# Altium schematic sheet F.SchDoc
size A
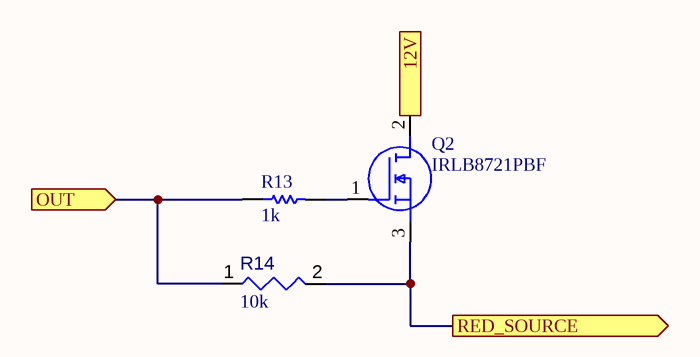
[diagram p0: F.SchDoc]

## Parts
Q2  IRLB8721PBF  [TO254P483X1016X1994-3P]
R13  value 1k  [RESC3116X70X50ML13T20]  (hidden comment: Resistor 1k +/-1% 1206 250 mW)
R14  value 10k  [RESC2013X50X35ML15T15]  (hidden comment: Resistor 10k +/-1% 0805 125 mW)

## Ports
12V (in), OUT (in), RED_SOURCE (out)

## Nets
12V: Q2.2(D) ; port 12V
OUT: R13.1 R14.1 ; port OUT
RED_SOURCE: Q2.3(S) R14.2 ; port RED_SOURCE
NetQ2_1: Q2.1(G) R13.2

## Library data of the parts
Q2 = IRLB8721PBF: MOSFET (N-Channel); Manufacturer_Name: Infineon; Datasheet Link: http://uk.rs-online.com/web/p/products/7259322; Height: 4.83mm; Manufacturer_Part_Number: IRLB8721PBF; Mouser Part Number: 942-IRLB8721PBF; Mouser Price/Stock: https://www.mouser.co.uk/ProductDetail/Infineon-Technologies/IRLB8721PBF?qs=9%252BKlkBgLFf0T58WYx%2FAl5A%3D%3D; Arrow Part Number: IRLB8721PBF; Arrow Price/Stock: https://www.arrow.com/en/products/irlb8721pbf/infineon-technologies-ag?utm_currency=USD&region=europe
R13 = CMP-009-00011-5: Chip Resistor, 1 KOhm, +/- 1%, 0.25 W, -55 to 155 degC, 1206 (3216 Metric); Voltage Rating: 200V; Power: 250mW; Max Operating Temperature: 155°C; Mounting Technology: SM; Tolerance: 1%; Case/Package: 1206; RoHS Compliant: True; Min Operating Temperature: -55°C; Pins: 2
R14 = CMP-009-00018-5: Chip Resistor, 10 KOhm, +/- 1%, 125 mW, -55 to 155 degC, 0805 (2012 Metric); Power: 125mW; Voltage Rating: 150V; Tolerance: 1%; Pins: 2; Min Operating Temperature: -55°C; Case/Package: 0805; Max Operating Temperature: 155°C; RoHS Compliant: True; Mounting Technology: SM